# EAGLE design MICHAv41 (EAGLE 9.2.2)
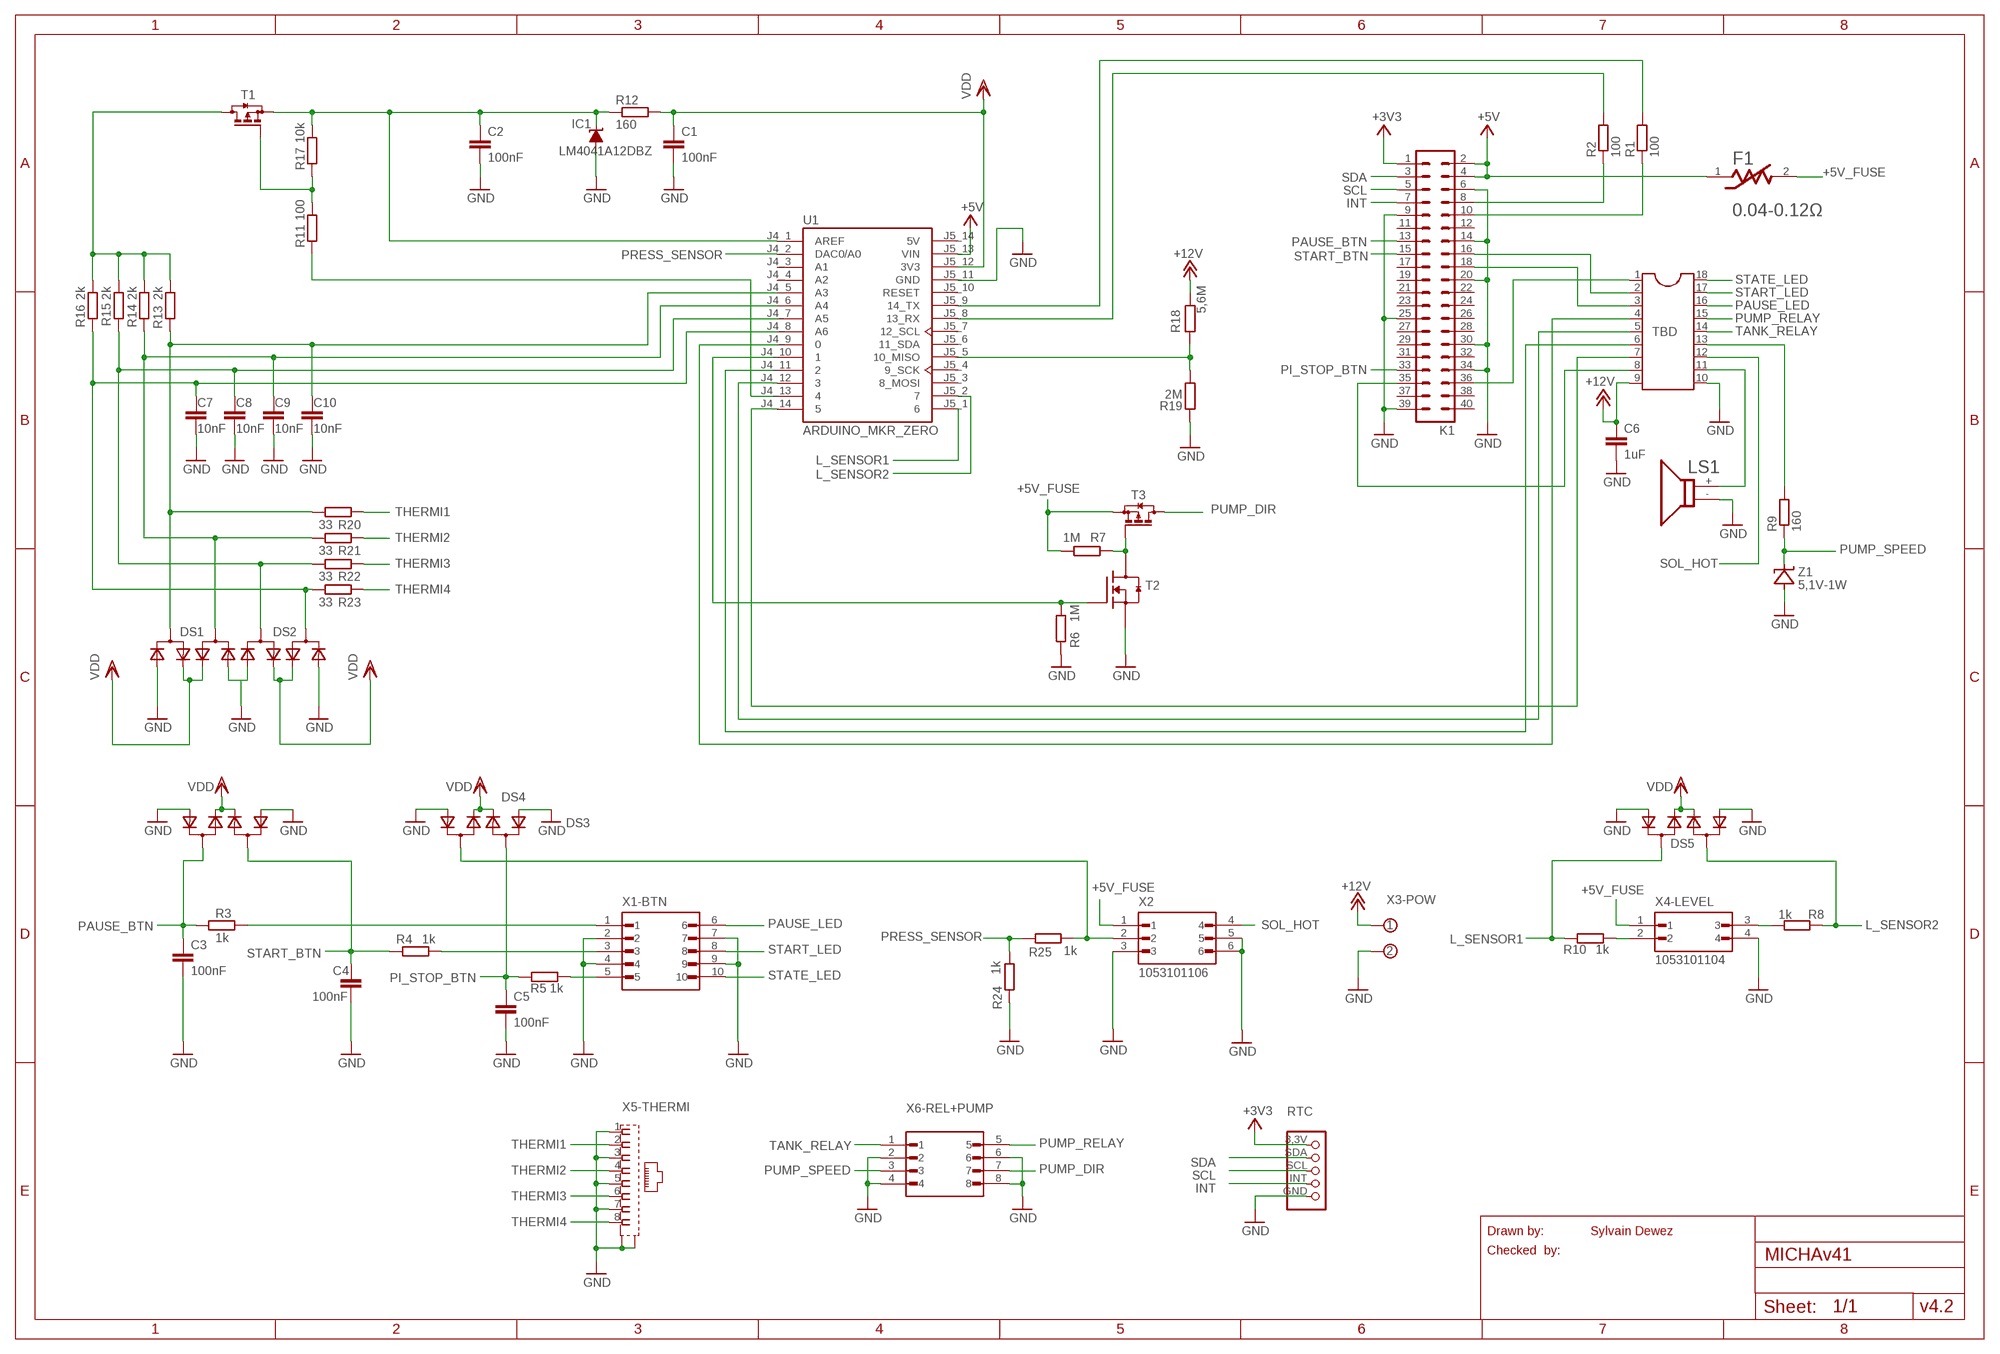
[diagram p0: schematic, sheet 1]

## Parts
C1  100nF  C-EUC1206  [C1206]
C2  100nF  C-EUC1206  [C1206]
C3  100nF  C-EUC1206  [C1206]
C4  100nF  C-EUC1206  [C1206]
C5  100nF  C-EUC1206  [C1206]
C6  1uF  C-EUC1206  [C1206]
C7  10nF  C-EUC1206  [C1206]
C8  10nF  C-EUC1206  [C1206]
C9  10nF  C-EUC1206  [C1206]
C10  10nF  C-EUC1206  [C1206]
DS1  CMXSH2-4LSTRPBFREE  [CMXSH2-4LSTRPBFREE]
DS2  CMXSH2-4LSTRPBFREE  [CMXSH2-4LSTRPBFREE]
DS3  CMXSH2-4LSTRPBFREE  [CMXSH2-4LSTRPBFREE]
DS4  CMXSH2-4LSTRPBFREE  [CMXSH2-4LSTRPBFREE]
DS5  CMXSH2-4LSTRPBFREE  [CMXSH2-4LSTRPBFREE]
F1  LITTELFUSE_INC_1206L150THWRLITTELFUSE_INC_1206L150THWR_0_0  [LITTELFUSE_INC_1206L150THWR_0]
IC1  LM4041A12DBZ  [DBZ_R-PDSO-G3]
K1  PIN20X2  [PIN_20X2]
LS1  RSPRO-BUZZER-7800743  [RSPRO-BUZZER-7800743]
R1  100  R-EU_R1206  [R1206]
R2  100  R-EU_R1206  [R1206]
R3  1k  R-EU_R1206  [R1206]
R4  1k  R-EU_R1206  [R1206]
R5  1k  R-EU_R1206  [R1206]
R6  1M  R-EU_R1206  [R1206]
R7  1M  R-EU_R1206  [R1206]
R8  1k  R-EU_R1206  [R1206]
R9  160  R-EU_R1206  [R1206]
R10  1k  R-EU_R1206  [R1206]
R11  100  R-EU_R1206  [R1206]
R12  160  R-EU_R1206  [R1206]
R13  2k  R-EU_R1206  [R1206]
R14  2k  R-EU_R1206  [R1206]
R15  2k  R-EU_R1206  [R1206]
R16  2k  R-EU_R1206  [R1206]
R17  10k  R-EU_R1206  [R1206]
R18  5,6M  R-EU_R1206  [R1206]
R19  2M  R-EU_R1206  [R1206]
R20  33  R-EU_R1206  [R1206]
R21  33  R-EU_R1206  [R1206]
R22  33  R-EU_R1206  [R1206]
R23  33  R-EU_R1206  [R1206]
R24  1k  R-EU_R1206  [R1206]
R25  1k  R-EU_R1206  [R1206]
RTC  ODROID_C4_RTC_SHIELD  [ODROID_C4_RTC_SHIELD]
T1  BSS84  [SOT23]
T2  MOSFET-NCH_SOT-23  [SOT95P280X135-3N]
T3  BSS84  [SOT23]
TBD  DIL18S  [SOCKET-18]
U1  ARDUINO_MKR_ZERO  [MODULE_ARDUINO_MKR_ZERO]
X1-BTN  1053101110  [MOLEX_1053101110]
X2  1053101106  [MOLEX_1053101106]
X3-POW  BUCHANAN_2_3.2MM  [BUCHANAN_2_3.5MM]
X4-LEVEL  1053101104  [MOLEX_1053101104]
X5-THERMI  SS-7188S-A-NF_V2  [BEL_SS-7188S-A-NF]
X6-REL+PUMP  1053101108  [MOLEX_1053101108]
Z1  5,1V-1W  ZENER_SMA  [ZENER_SMA]

## Nets
+3V3: K1.1 RTC.3,3V
+5V: F1.1 K1.2 K1.4 U1.J5_13(VIN)
+5V_FUSE: F1.2 R7.2 T3.2(S) X2.1 X4-LEVEL.1
+12V: C6.1 R18.2 TBD.9 X3-POW.1(KL)
BLACKOUT: R18.1 R19.2 U1.J5_5(10_MISO)
BTN_PAUSE: R3.2 X1-BTN.1
BTN_START: R4.2 X1-BTN.3
BTN_STOP: R5.2 X1-BTN.5
D0: TBD.4 U1.J4_9
D1: R6.2 T2.1(G) U1.J4_10
D2: TBD.6 U1.J4_11
D3: TBD.5 U1.J4_12
D5: TBD.7 U1.J4_14
D21: R11.1 U1.J4_13
GND: C1.2 C2.2 C3.2 C4.2 C5.2 C6.2 C7.2 C8.2 C9.2 C10.2 DS1.1(A3) DS1.6(A2) DS2.1(A3) DS2.6(A2) DS3.1(A3) DS3.6(A2) DS4.1(A3) DS4.6(A2) DS5.1(A3) DS5.6(A2) IC1.2(A) K1.6 K1.9 K1.14 K1.20 K1.25 K1.30 K1.34 K1.39 LS1.- R6.1 R19.1 R24.1 RTC.GND T2.2(S) TBD.10 U1.J5_11(GND) X1-BTN.2 X1-BTN.4 X1-BTN.7 X1-BTN.9 X2.3 X2.5 X2.6 X3-POW.2(KL1) X4-LEVEL.4 X5-THERMI.1 X5-THERMI.3 X5-THERMI.5 X5-THERMI.7 X5-THERMI.S1(GND1) X5-THERMI.S2(GND2) X6-REL+PUMP.2 X6-REL+PUMP.4 X6-REL+PUMP.6 X6-REL+PUMP.8 Z1.A
INT: K1.7 RTC.INT
L_SENSOR1: DS5.5(C) R10.1 U1.J5_1
L_SENSOR2: DS5.2(C1) R8.1 U1.J5_2
N$1: K1.36 TBD.1
N$2: R9.2 TBD.13
N$3: R11.2 R17.1 T1.1(G)
N$4: C2.1 IC1.1(C) R12.1 R17.2 T1.2(S) U1.J4_1(AREF)
N$6: R13.1 R14.1 R15.1 R16.1 T1.3(D)
N$11: C10.1 DS1.2(C1) R13.2 R20.1 U1.J4_5(A3)
N$12: C9.1 DS1.5(C) R14.2 R21.1 U1.J4_6(A4)
N$13: C8.1 DS2.2(C1) R15.2 R22.1 U1.J4_7(A5)
N$14: C7.1 DS2.5(C) R16.2 R23.1 U1.J4_8(A6)
N$26: LS1.+ TBD.11
N$27: R7.1 T2.3(D) T3.1(G)
PAUSE_BTN: C3.1 DS3.5(C) K1.13 R3.1
PAUSE_LED: TBD.16 X1-BTN.6
PI16: K1.16 TBD.2
PI18: K1.18 TBD.3
PI33: K1.35 TBD.8
PI_STOP_BTN: C5.1 DS4.2(C1) K1.33 R5.1
PRESS_SENSOR: R24.2 R25.1 U1.J4_2(DAC0/A0)
PUMP_DIR: T3.3(D) X6-REL+PUMP.7
PUMP_RELAY: TBD.15 X6-REL+PUMP.5
PUMP_SPEED: R9.1 X6-REL+PUMP.3 Z1.C
RX_A: R2.2 U1.J5_8(13_RX)
RX_PI: K1.10 R1.1
SCL: K1.5 RTC.SCL
SDA: K1.3 RTC.SDA
SENSOR: DS4.5(C) R25.2 X2.2
SENSOR1: R10.2 X4-LEVEL.2
SENSOR2: R8.2 X4-LEVEL.3
SOL_HOT: TBD.12 X2.4
START_BTN: C4.1 DS3.2(C1) K1.15 R4.1
START_LED: TBD.17 X1-BTN.8
STATE_LED: TBD.18 X1-BTN.10
TANK_RELAY: TBD.14 X6-REL+PUMP.1
THERMI1: R20.2 X5-THERMI.2
THERMI2: R21.2 X5-THERMI.4
THERMI3: R22.2 X5-THERMI.6
THERMI4: R23.2 X5-THERMI.8
TX_A: R1.2 U1.J5_9(14_TX)
TX_PI: K1.8 R2.1
VDD: C1.1 DS1.3(A4) DS1.4(A1) DS2.3(A4) DS2.4(A1) DS3.3(A4) DS3.4(A1) DS4.3(A4) DS4.4(A1) DS5.3(A4) DS5.4(A1) R12.2 U1.J5_12(3V3)
Unconnected: K1.11 K1.12 K1.17 K1.19 K1.21 K1.22 K1.23 K1.24 K1.26 K1.27 K1.28 K1.29 K1.31 K1.32 K1.37 K1.38 K1.40 U1.J4_3(A1) U1.J4_4(A2) U1.J5_3(8_MOSI) U1.J5_4(9_SCK) U1.J5_6(11_SDA) U1.J5_7(12_SCL) U1.J5_10(RESET)

## Notes on the sheet
- Drawn by: | Sylvain Dewez
- Checked  by:
- v4.2

## Power pins joined to a net without a drawn wire
5V: U1.J5_14(5V)

## Library data of the parts
C1-C10 = rcl:C-EU: CAPACITOR, European symbol; SPICEPREFIX: C
DS1-DS5 = SchottkyDiodes_SDM10M45SD:CMXSH2-4LSTRPBFREE
F1 = Littelfuse Inc - 1206L150THWR_1:LITTELFUSE_INC_1206L150THWR: Polymeric PTC Resettable Fuse 8V 1.5A Ih Surface Mount 1206 (3216 Metric), Concave; AMBIENT_TEMPERATURE_RANGE_HIGH: +85°C; AMBIENT_TEMPERATURE_RANGE_LOW: -40°C; AUTOMOTIVE: No; CENTROID_NOT_SPECIFIED: No; CURRENT_RATING: 100A; DATASHEET: https://www.littelfuse.com/~/media/electronics/datasheets/resettable_ptcs/littelfuse_ptc_1206l_datasheet.pdf.pdf; DEVICE_CLASS_L1: Circuit Protection; DEVICE_CLASS_L2: PTC Resettable Fuses; DEVICE_CLASS_L3: unset; DIGIKEY_DESCRIPTION: PTC RESET FUSE 8V 1.5A 1206; DIGIKEY_PART_NUMBER: F3372CT-ND; FOOTPRINT_VARIANT_NAME_0: Recommended_Land_Pattern; HEIGHT: 1mm; HOLD_CURRENT: 1.5A; LEAD_FREE: Yes; MF: Littelfuse Inc; MFG_PACKAGE_IDENT: 0; MFG_PACKAGE_IDENT_DATE: 0; MFG_PACKAGE_IDENT_REV: 0; MOUSER_DESCRIPTION: Resettable Fuses - PPTC PTC 6V 1206 1.5A POLYFUSE SMD THIN; MOUSER_PART_NUMBER: 576-1206L150THWR; MPN: 1206L150THWR; PACKAGE: 1206; PREFIX: F; RESISTANCE: 0.04-0.12Ω; ROHS: Yes; TEMPERATURE_RANGE_HIGH: +85°C; TEMPERATURE_RANGE_LOW: -40°C; TRIP_CURRENT: 3A; TRIP_TIME: 0.3s; VERIFICATION_VERSION: 0.0.0.3; VOLTAGE_RATING: 8V
IC1 = texas:LM4041: PRECISION MICROPOWER SHUNT VOLTAGE REFERENCE Source: http://focus.ti.com/lit/ds/slcs146e/slcs146e.pdf; MPN: LM4041A12IDBZR; OC_FARNELL: 1407949; OC_NEWARK: 58K5875
K1 = FLYFISH:PIN20X2
LS1 = RSpro-buzzer-7800743:RSPRO-BUZZER-7800743: Rs pro piezo buzzer 780-0743 Diamètre: 16 mm Hauteur: 14,5 mm Empattement: 7,6 mm Diamètre trou: 0,7 mm Tension de fonctionnement: 9-15 V Courant de fonctionnement: 40 mA Résistance: 115 ohms Référence: 780-0743 Datasheet: https://docs.rs-online.com/ff3f/0900766b81582bd9.pdf
R1-R8 R10 R11 R13-R25 = resistor:R-EU_: RESISTOR, European symbol
R9 R12 = rcl:R-EU_: RESISTOR, European symbol; SPICEPREFIX: R
RTC = Odroid_C4_RTC_SHIELD:ODROID_C4_RTC_SHIELD
T1 T3 = transistor-small-signal:BSS84: P-CHANNEL MOS FET
T2 = ipc-7351-transistor:MOSFET-NCH_
TBD = ic-package:DIL18: Dual In Line / Socket
U1 = ARDUINO_MKR_ZERO:ARDUINO_MKR_ZERO: ATSAMD21 Arduino MKR Zero with Headers SAM D ARM® Cortex®-M0+ MCU 32-Bit Embedded Evaluation Board; AVAILABILITY: Unavailable; DESCRIPTION: ATSAMD21 Arduino MKR Zero with Headers SAM D ARM® Cortex®-M0+ MCU 32-Bit Embedded Evaluation Board; MF: Arduino; MP: ARDUINO MKR ZERO; PACKAGE: None; PRICE: None
X1-BTN = con-molex-nanoFit-105310-1110:1053101110: Nano-Fit Vertical Header, Through Hole, 2.50mm Pitch, Dual Row, 8 Circuits, with Kinked Pins, Tin (Sn) Plating, Black, Glow-Wire Capable, Tray; MANUFACTURER: Molex; MAXIMUM_PACKAGE_HEIGHT: 10.51 mm; PARTREV: H; STANDARD: Manufacturer Recommendations
X2 = con-molex-nanoFit-105310-1106:1053101106: Nano-Fit Vertical Header, Through Hole, 2.50mm Pitch, Dual Row, 6 Circuits, with Kinked Pins, Tin (Sn) Plating, Black, Glow-Wire Capable, Tray; MANUFACTURER: Molex; MAXIMUM_PACKAGE_HEIGHT: 10.51 mm; PARTREV: H; STANDARD: Manufacturer Recommendations
X3-POW = con-TEconnectivity:BUCHANAN_2_3.2MM
X4-LEVEL = con-molex-nanoFit-105310-1104:1053101104: Nano-Fit Vertical Header, Through Hole, 2.50mm Pitch, Dual Row, 4 Circuits, with Kinked Pins, Tin (Sn) Plating, Black, Glow-Wire Capable, Tray; MANUFACTURER: Molex; MAXIMUM_PACKAGE_HEIGHT: 10.51 mm; PARTREV: H; STANDARD: Manufacturer Recommendations
X5-THERMI = SS-7188S-A-NF:SS-7188S-A-NF_V2: Modular Jack | CAT5E | Horizontal (90) | 8P 8C | NF Shielded Check prices <https://pricing.snapeda.com/parts/SS-7188S-A-NF/Stewart%20Connector/view-part?ref=eda>; AVAILABILITY: Warning; DESCRIPTION: Jack Modular Connector 8p8c (RJ45, Ethernet) 90° Angle (Right) Shielded Cat5e; MF: Stewart Connector; MP: SS-7188S-A-NF; PACKAGE: None; PRICE: None; PURCHASE-URL: https://pricing.snapeda.com/search/part/SS-7188S-A-NF/?ref=eda
X6-REL+PUMP = con-molex-nanoFit-105310-1108:1053101108: Nano-Fit Vertical Header, Through Hole, 2.50mm Pitch, Dual Row, 8 Circuits, with Kinked Pins, Tin (Sn) Plating, Black, Glow-Wire Capable, Tray; MANUFACTURER: Molex; MAXIMUM_PACKAGE_HEIGHT: 10.51 mm; PARTREV: H; STANDARD: Manufacturer Recommendations
Z1 = Zener_SMA:ZENER_SMA

## Board
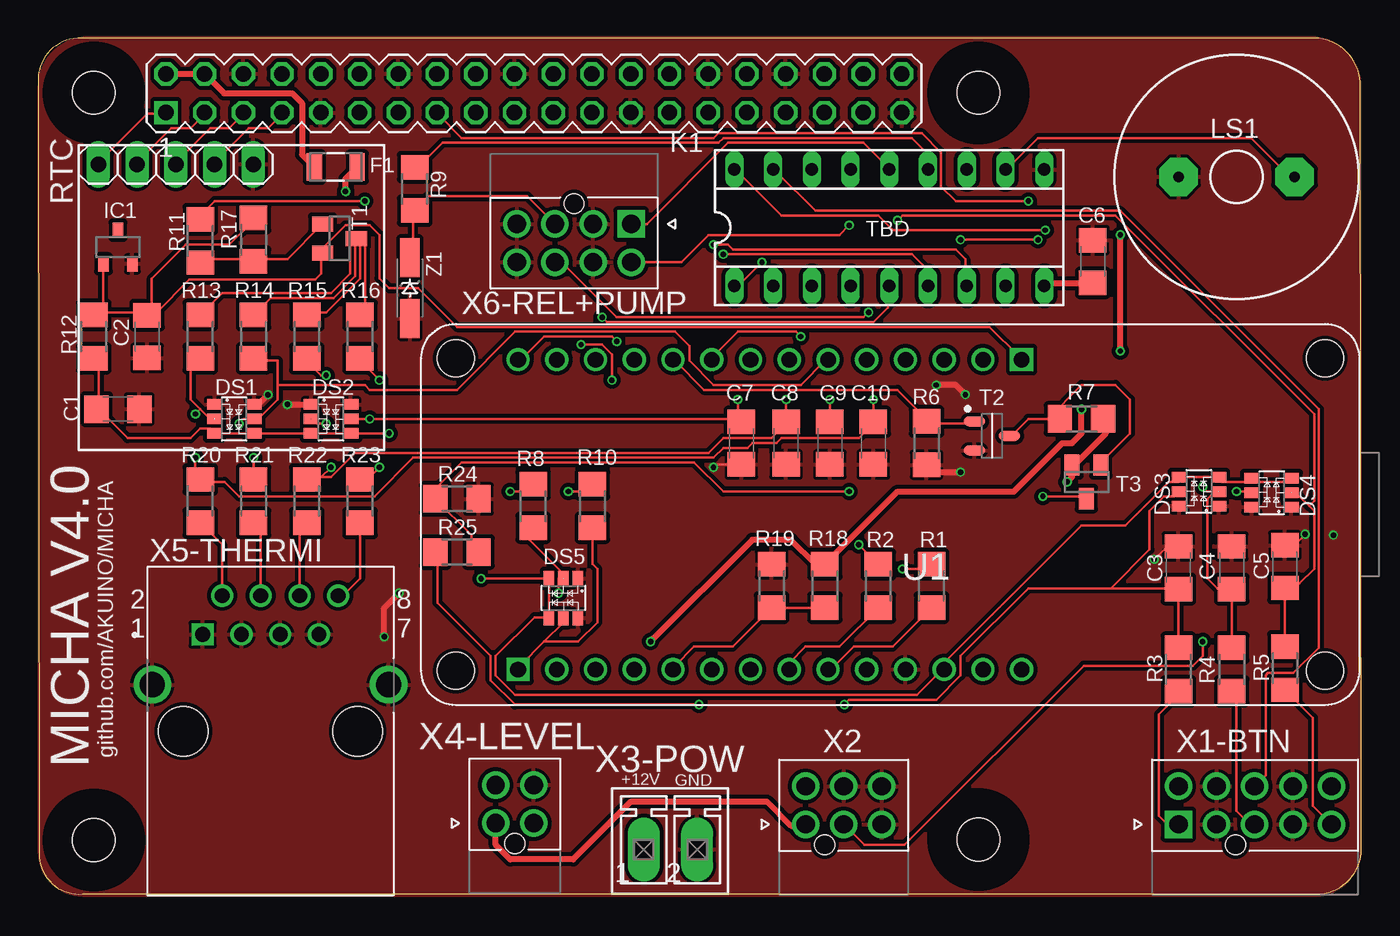
[diagram p1: board, top side]
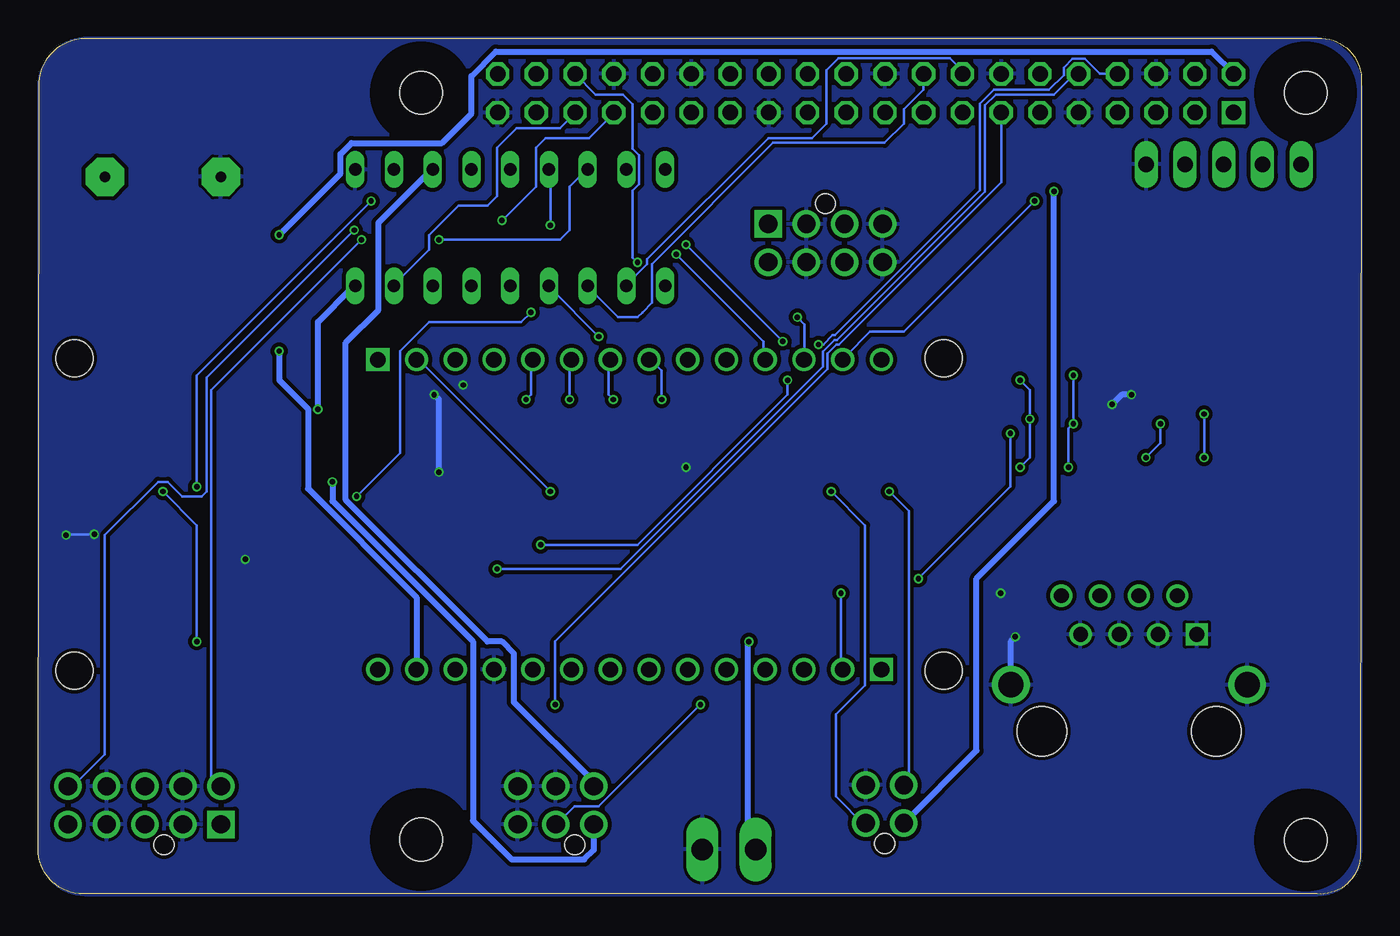
[diagram p2: board, bottom side, seen from below]

Size 86.76 x 56.13 mm. Coordinates in mm from the lower left corner, seen from the top.
Outline: 0.08,2.38 arc90 2.91,0.01 83.81,0.01 arc90 86.76,2.96 86.68,53.25 arc90 83.41,56.12 2.84,56.12 arc90 0,53.52 0.08,2.38
Copper layers (1*16): Top 0.018mm / dielectric 1.55mm / Bottom 0.018mm
Design rules "eC_2Layer_PClass6_BaseCopperO18_eCDefault *": minimum track width 6mil, minimum drill 0.35mm, track to track 0.15mm, track to pad 0.15mm, pad to pad 0.15mm, via to via 0.15mm, smd to smd 0mil, copper to edge 0mil, drill to drill 0.35mm, minimum pad ring 0.175mm, minimum via ring 0.125mm, stop-mask expansion 0mil, vias tented up to drill 0.45mm, thermal gap 0.2mm
Holes 2.8 mm at 3.65,3.54 3.65,52.54 61.65,52.54 61.65,3.57
tRestrict: area 2.1,51 to 5.2,54.1; area 60.1,51 to 63.2,54.1; area 2.1,2 to 5.2,5.1; area 60.1,2 to 63.2,5.1
bRestrict: area 2.1,2 to 5.2,5.1; area 2.1,51 to 5.2,54.1; area 60.1,51 to 63.2,54.1; area 60.1,2 to 63.2,5.1

### Footprints (pad centres in the part's own frame; a part is rotated, then mirrored left to right if it is on the bottom)
C1206 = smd 1.6 x 1.8: 1 -1.4,0; 2 1.4,0
CMXSH2-4LSTRPBFREE = smd 0.69 x 0.99: 1 -0.95,-1.29; 2 0,-1.29; 3 0.95,-1.29; 4 0.95,1.3; 5 0,1.3; 6 -0.95,1.3
LITTELFUSE_INC_1206L150THWR_0 = smd 1 x 1.8: 1 -1.4,0; 2 1.4,0
DBZ_R-PDSO-G3 = smd 0.7 x 1: 1 -0.95,-1.1; 2 0.95,-1.1; 3 0,1.1
PIN_20X2 = drill 1.016 square: 1 -24.13,-1.27 | drill 1.016 octagon: 2 -24.13,1.27; 3 -21.59,-1.27; 4 -21.59,1.27; 5 -19.05,-1.27; 6 -19.05,1.27; 7 -16.51,-1.27; 8 -16.51,1.27; 9 -13.97,-1.27; 10 -13.97,1.27; 11 -11.43,-1.27; 12 -11.43,1.27; 13 -8.89,-1.27; 14 -8.89,1.27; 15 -6.35,-1.27; 16 -6.35,1.27; 17 -3.81,-1.27; 18 -3.81,1.27; 19 -1.27,-1.27; 20 -1.27,1.27; 21 1.27,-1.27; 22 1.27,1.27; 23 3.81,-1.27; 24 3.81,1.27; 25 6.35,-1.27; 26 6.35,1.27; 27 8.89,-1.27; 28 8.89,1.27; 29 11.43,-1.27; 30 11.43,1.27; 31 13.97,-1.27; 32 13.97,1.27; 33 16.51,-1.27; 34 16.51,1.27; 35 19.05,-1.27; 36 19.05,1.27; 37 21.59,-1.27; 38 21.59,1.27; 39 24.13,-1.27; 40 24.13,1.27
RSPRO-BUZZER-7800743 = drill 0.7 pad 2.54 octagon: + 3.8,0; - -3.8,0
R1206 = smd 1.6 x 1.803: 1 -1.422,0; 2 1.422,0
ODROID_C4_RTC_SHIELD = drill 1.016 long: 3,3V -5.08,0; GND 5.08,0; INT 2.54,0; SCL 0,0; SDA -2.54,0
SOT23 = smd 1 x 1.4: 1 -0.95,-1.1; 2 0.95,-1.1; 3 0,1.1
SOT95P280X135-3N = smd 1.4 x 0.65: 1 -1.15,0.95; 2 -1.15,-0.95; 3 1.15,0
SOCKET-18 = drill 0.813 long: 1 -10.16,-3.81; 2 -7.62,-3.81; 3 -5.08,-3.81; 4 -2.54,-3.81; 5 0,-3.81; 6 2.54,-3.81; 7 5.08,-3.81; 8 7.62,-3.81; 9 10.16,-3.81; 10 10.16,3.81; 11 7.62,3.81; 12 5.08,3.81; 13 2.54,3.81; 14 0,3.81; 15 -2.54,3.81; 16 -5.08,3.81; 17 -7.62,3.81; 18 -10.16,3.81
MODULE_ARDUINO_MKR_ZERO = drill 1.02 square: J4_1 -8.615,-10.16; J5_1 24.405,10.16 | drill 1.02: J4_2 -6.075,-10.16; J4_3 -3.535,-10.16; J4_4 -0.995,-10.16; J4_5 1.545,-10.16; J4_6 4.085,-10.16; J4_7 6.625,-10.16; J4_8 9.165,-10.16; J4_9 11.705,-10.16; J4_10 14.245,-10.16; J4_11 16.785,-10.16; J4_12 19.325,-10.16; J4_13 21.865,-10.16; J4_14 24.405,-10.16; J5_2 21.865,10.16; J5_3 19.325,10.16; J5_4 16.785,10.16; J5_5 14.245,10.16; J5_6 11.705,10.16; J5_7 9.165,10.16; J5_8 6.625,10.16; J5_9 4.085,10.16; J5_10 1.545,10.16; J5_11 -0.995,10.16; J5_12 -3.535,10.16; J5_13 -6.075,10.16; J5_14 -8.615,10.16 | hole 2.42: -28.5,-10.25; -28.5,10.25; 28.5,10.25; 28.5,-10.25
MOLEX_1053101110 = drill 1.2 pad 1.7 square: 1 0,0 | drill 1.2 pad 1.7: 2 2.5,0; 3 5,0; 4 7.5,0; 5 10.04,0; 6 0,2.5; 7 2.5,2.5; 8 5,2.5; 9 7.5,2.5; 10 10.04,2.5 | hole 1.3: 3.75,-1.34
MOLEX_1053101106 = drill 1.2 pad 1.7: 1 0,0; 2 2.5,0; 3 5,0; 4 0,2.5; 5 2.5,2.5; 6 5,2.5 | hole 1.3: 1.25,-1.34
BUCHANAN_2_3.5MM = drill 1.397 long: 1 -1.722,0; 2 1.778,0
MOLEX_1053101104 = drill 1.2 pad 1.7: 1 0,0; 2 2.5,0; 3 0,2.5; 4 2.5,2.5 | hole 1.3: 1.25,-1.34
BEL_SS-7188S-A-NF = drill 0.97 square: 1 -4.445,6.35 | drill 0.97: 2 -3.175,8.89; 3 -1.905,6.35; 4 -0.635,8.89; 5 0.635,6.35; 6 1.905,8.89; 7 3.175,6.35; 8 4.445,8.89 | drill 1.65: S1 -7.745,3.05; S2 7.745,3.05 | hole 3.25: 5.715,0; -5.715,0
MOLEX_1053101108 = drill 1.2 pad 1.7 square: 1 0,0 | drill 1.2 pad 1.7: 2 2.5,0; 3 5,0; 4 7.5,0; 5 0,2.5; 6 2.5,2.5; 7 5,2.5; 8 7.5,2.5 | hole 1.3: 3.75,-1.34
ZENER_SMA = smd 2.54 x 1.27: A 2,0; C -2,0

### Placement (x,y rotation side)
C1  5.23,31.79 0 top
C2  7.14,36.56 270 top
C3  74.76,21.4 90 top
C4  78.26,21.4 90 top
C5  81.75,21.48 90 top
C6  69.14,41.48 90 top
C7  46.11,29.57 270 top
C8  49.05,29.57 270 top
C9  51.9,29.57 270 top
C10  54.76,29.57 270 top
DS1  12.85,31.16 270 top
DS2  19.2,31.16 270 top
DS3  76.11,26.4 90 top
DS4  80.88,26.32 90 top
DS5  34.44,19.41 180 top
F1  19.52,47.67 0 top
IC1  5.23,42.43 0 top
K1  32.5,52.51 0 top
LS1  78.57,47.03 0 top
R1  58.57,20.21 270 top
R2  55.08,20.21 270 top
R3  74.76,14.73 270 top
R4  78.26,14.73 270 top
R5  81.75,14.81 270 top
R6  58.25,29.57 90 top
R7  68.41,31.16 0 top
R8  32.46,25.44 90 top
R9  24.69,46.24 90 top
R10  36.35,25.44 90 top
R11  10.63,42.83 270 top
R12  3.64,36.56 270 top
R13  10.63,36.56 270 top
R14  14.12,36.56 270 top
R15  17.61,36.56 270 top
R16  21.11,36.56 270 top
R17  14.12,42.91 90 top
R18  51.59,20.21 90 top
R19  48.09,20.21 270 top
R20  10.63,25.76 270 top
R21  14.12,25.76 270 top
R22  17.61,25.76 270 top
R23  21.11,25.76 270 top
R24  27.46,25.92 180 top
R25  27.46,22.43 180 top
RTC  9.02,47.85 0 top
T1  19.76,42.99 270 top
T2  62.54,30.05 0 top
T3  68.73,27.03 180 top
TBD  55.8,43.7 0 top
U1  55.87,24.89 180 top
X1-BTN  74.76,4.57 0 top
X2  50.32,4.57 0 top
X3-POW  41.43,2.92 0 top
X4-LEVEL  30,4.65 0 top
X5-THERMI  15.23,10.68 0 top
X6-REL+PUMP  38.89,43.94 180 top
Z1  24.37,39.73 270 top

### Tracks (layer width: path | path; a pad name or v marks a point on that pad's centre or on a via)
+3V3
  Top 0.152: RTC.3,3V 3.96,47.99 7.14,51.16 8.09,51.16 K1.1
+5V  (via drill 0.35)
  Top 0.406: K1.2 K1.4 12.19,52.51 16.66,52.51 17.3,51.88 17.3,48.49 F1.1 | v70.95,35.6 v70.95,43.22
  Bottom 0.406: v70.95,35.6 70.95,33.7 69.07,31.81 69.07,26.58 61.95,19.46 U1.J5_13 | v70.95,43.22 66.93,47.25 66.93,48.52 66.21,49.24 60.28,49.24 58.35,51.18 58.35,53.64 56.75,55.24 9.83,55.24 K1.2
+5V_FUSE  (via drill 0.35)
  Top 0.152: 68.1,28.3 T3.2 | 70,31.16 R7.2
  Top 0.406: v20.16,46.08 20.16,46.9 F1.2 | X2.1 50.24,4.49 49.36,4.49 47.78,6.08 38.89,6.08 35.08,2.27 30.95,2.27 30,3.22 X4-LEVEL.1 | 68.1,28.3 70,30.21 70,31.16 | T3.2 67.78,27.35 v67.46,27.03
  Bottom 0.406: X4-LEVEL.1 25.23,9.41 25.23,20.68 20.16,25.76 v20.16,46.08 | v67.46,27.03 67.46,25.76 58.25,16.55 58.25,4.81 55.71,2.27 50.95,2.27 50.32,2.9 X2.1
+12V  (via drill 0.35)
  Top 0.152: 69.05,40.05 C6.1 | 50.95,21.63 R18.2
  Top 0.406: 69.05,40.05 66.19,40.05 TBD.9 | R18.2 56.35,26.4 63.97,26.4 67.15,29.57 67.78,29.57 68.42,30.21 v68.42,31.79 | v40.16,16.55 46.82,23.22 49.36,23.22 50.95,21.63
  Bottom 0.152: 39.84,3.22 X3-POW.1
  Bottom 0.406: v68.42,31.79 68.42,37.51 66.19,39.73 TBD.9 | 39.84,3.22 40.24,3.62 40.24,16.48 v40.16,16.55
BLACKOUT
  Top 0.152: R19.2 R18.1 | R19.2 45.56,16.24 43.01,16.24 41.75,14.97 U1.J5_5 | R19.2
BTN_PAUSE
  Top 0.152: R3.2 74.76,13.06 73.5,11.79 73.5,5.12 74.05,4.57 X1-BTN.1
BTN_START
  Top 0.152: R4.2 78.57,12.99 78.57,5.44 79.45,4.57 X1-BTN.3
BTN_STOP
  Top 0.152: R5.2 83.58,11.56 83.58,5.8 X1-BTN.5
D0  (via drill 0.35)
  Top 0.152: v50,36.56 49.68,36.87 45.87,36.87 44.29,35.29 U1.J4_9
  Bottom 0.152: v50,36.56 53.18,39.73 TBD.4
D1
  Top 0.152: T2.1 61.11,30.84 58.25,30.84 R6.2 58.25,31.16 56.35,33.06 43.65,33.06 41.75,34.97 U1.J4_10
D2  (via drill 0.35)
  Top 0.152: v44.92,41.95 57.3,41.95 58.25,41 58.25,40.05 TBD.6
  Bottom 0.152: v44.92,41.95 39.21,36.24 39.21,35.29 U1.J4_11
D3  (via drill 0.35)
  Top 0.152: v36.98,37.83 37.3,37.51 54.76,37.51 55.71,38.46 55.71,39.73 TBD.5
  Bottom 0.152: v36.98,37.83 36.51,37.35 36.51,35.09 U1.J4_12
D5  (via drill 0.35)
  Top 0.152: v44.29,42.59 45.24,42.59 45.56,42.27 60.16,42.27 60.79,41.64 60.79,40.05 TBD.7 | v37.93,36.24 37.62,36.56 33.17,36.56 31.9,35.29 31.59,35.29 U1.J4_14
  Bottom 0.152: v37.93,36.24 v44.29,42.59
D21  (via drill 0.35)
  Top 0.152: v21.43,45.45 11.58,45.45 10.63,44.49 R11.1
  Bottom 0.152: v21.43,45.45 30,36.87 32.22,36.87 33.81,35.29 U1.J4_13
GND  (via drill 0.35)
  Top 0.152: C5.2 82.36,22.88 v83.07,23.59 | C7.2 44.47,28.17 v44.29,27.98 | C3.2 74.02,22.8 v73.18,21.95
  Top 0.406: R6.1 58.74,27.67 v60.48,27.67 | v60.79,32.75 60.16,33.38 v58.89,33.38 | v22.7,16.87 22.7,18.78 v23.65,19.73 | DS1.6 14.44,32.11 v15.07,32.75 | v16.34,32.11 v16.35,32.11 DS2.1
  Bottom 0.152: v83.07,23.59 84.87,23.59 v84.92,23.54
  Bottom 0.406: v60.48,27.67 60.48,32.43 v60.79,32.75 | X5-THERMI.S2 22.98,16.59 v22.7,16.87 | v15.07,32.75 15.71,32.75 v16.34,32.11
  pour Bottom (isolate 0.254): 0.08,2.81 arc90 2.92,-0.04 83.65,-0.04 arc90 86.66,2.98 86.66,52.89 arc90 83.42,56.12 3.32,56.12 arc90 0.08,52.89
  pour Top (isolate 0.254): 0.08,2.81 arc90 2.92,-0.04 83.84,-0.04 arc90 86.66,3.12 86.66,52.89 arc90 83.42,56.12 3.32,56.12 arc90 0.08,52.89
INT
  Top 0.152: RTC.INT 11.58,47.99 13.8,50.21 15.07,50.21 16.03,51.16 K1.7
L_SENSOR1
  Top 0.152: 33.17,16.55 31.59,14.97 U1.J5_1 | 33.17,16.55 34.44,17.82 DS5.5 | R10.1 36.35,21.63 36.67,21.32 36.67,17.82 35.39,16.55 33.17,16.55
L_SENSOR2  (via drill 0.35)
  Top 0.152: R8.1 32.22,23.86 32.22,23.22 34.44,21 DS5.2 34.44,20.68 34.12,20.68 v34.12,19.73
  Bottom 0.152: v34.12,19.73 34.12,14.97 U1.J5_2
N$1  (via drill 0.35)
  Top 0.152: v47.46,41.43 45.92,39.89 TBD.1
  Bottom 0.152: K1.36 50.2,52.43 48.41,52.43 47.78,51.8 47.78,48.9 47.35,48.47 47.35,46.56 47.78,46.13 47.78,41.75 v47.46,41.43
N$2
  Top 0.152: R9.2 24.92,47.67 26.5,49.26 44.6,49.26 44.92,49.57 57.3,49.57 58.25,48.62 58.25,47.67 TBD.13
N$3
  Top 0.152: 14.12,41.64 16.34,41.64 18.57,43.86 T1.1 | 14.12,41.64 10.63,41.64 R11.2 | 14.12,41.64 R17.1
N$4
  Top 0.152: 4.28,38.14 4.28,41.32 IC1.1 | 4.28,38.14 3.65,38.14 R12.1 4.28,38.14 | 7.14,38.14 7.46,38.14 | 7.46,38.14 7.77,38.14 9.92,40.29 18.17,40.29 18.57,40.68 18.57,41.95 T1.2 18.57,42.27 20.16,43.86 21.74,43.86 22.38,43.22 22.38,40.37 23.01,39.73 24.92,39.73 27.46,37.19 62.38,37.19 64.29,35.29 U1.J4_1 | 7.46,38.14 7.46,40.37 9.68,42.59 12.54,42.59 14.12,44.18 R17.2 | 7.46,38.14 C2.1 7.14,38.14 | 7.14,38.14 4.28,38.14
N$6
  Top 0.152: R16.1 21.43,38.3 21.43,42.99 21.11,42.99 | 21.11,42.99 T1.3 | R15.1 17.78,38.14 18.89,38.14 21.11,40.37 21.11,42.99 | R14.1 15.24,39.1 19.36,39.1 20.79,40.53 20.79,42.92 T1.3 | R13.1 12.07,39.41 19.2,39.41 20.46,40.67 20.46,42.59 T1.3
N$11  (via drill 0.35)
  Top 0.152: v54.76,32.43 C10.1 54.76,30.84 53.81,29.89 48.73,29.89 48.41,29.57 46.82,29.57 46.51,29.25 44.92,29.25 44.29,28.62 24.6,28.62 22.06,26.08 13.17,26.08 12.22,27.03 10.63,27.03 R20.1 10.31,27.5 v10.31,28.62 | 10.63,31.79 9.99,32.43 9.99,34.97 10.63,34.97 R13.2 | 10.63,31.79 11.27,31.16 DS1.2 | 10.63,31.79 v10.31,31.48
  Bottom 0.152: v54.76,32.43 54.44,32.75 54.44,34.97 U1.J4_5 | v10.31,31.48 v10.31,28.62
N$12  (via drill 0.35)
  Top 0.152: v51.9,32.43 C9.1 | 15.71,33.38 15.71,34.97 14.12,34.97 R14.2 | 15.71,33.38 15.71,32.43 14.44,31.16 DS1.5 13.49,31.16 v13.17,30.84 | v14.12,28.62 R21.1 | 15.71,33.38 21.43,33.38 21.74,33.06 27.46,33.06 31.27,36.87 41.75,36.87 42.7,35.92 42.7,34.97 44.29,33.38 50,33.38 51.59,34.97 U1.J4_6
  Bottom 0.152: v51.9,32.43 51.9,34.97 U1.J4_6 | v14.12,28.62 13.17,29.57 v13.17,30.84
N$13  (via drill 0.35)
  Top 0.152: v49.05,32.43 C8.1 49.05,30.84 48.1,29.89 44.92,29.89 43.97,28.94 20.79,28.94 19.2,27.35 18.57,27.35 | v18.89,30.84 18.25,30.84 17.93,31.16 DS2.2 | 18.57,27.35 v19.2,27.98 | 18.57,27.35 17.61,27.35 R22.1 | v18.89,34.02 18.57,34.02 17.61,34.97 R15.2
  Bottom 0.152: v49.05,32.43 49.36,32.75 49.36,34.97 U1.J4_7 | v19.2,27.98 19.2,30.52 v18.89,30.84 v18.89,34.02
N$14  (via drill 0.35)
  Top 0.152: 45.87,31.16 45.56,31.16 | 45.56,31.16 v21.74,31.16 DS2.5 | 45.87,31.16 C7.1 45.56,31.16 | v22.38,27.98 21.58,27.18 R23.1 | v22.38,33.7 21.11,34.97 R16.2 | 45.87,31.16 v45.87,32.43
  Bottom 0.152: v22.38,27.98 21.74,28.62 v21.74,31.16 21.74,33.06 v22.38,33.7 | v45.87,32.43 45.87,34.33 46.51,34.97 U1.J4_8
N$26
  Top 0.152: TBD.11 63.65,47.67 65.56,49.57 79.53,49.57 82.07,47.03 LS1.+
N$27
  Top 0.152: 66.19,31.16 64.92,31.16 63.97,30.21 T2.3 | R7.1 66.19,31.16 | 66.19,31.16 68.42,33.38 70.64,33.38 71.59,32.43 71.59,30.21 69.68,28.3 T3.1
PAUSE_BTN  (via drill 0.35)
  Top 0.152: DS3.5 74.76,26.4 74.45,26.08 73.81,26.08 72.86,25.13 72.86,22.59 70.32,20.05 | R3.1 C3.1 74.76,20.05 70.32,20.05 | v52.86,12.43 53.18,12.74 58.89,12.74 60.48,14.33 60.48,15.6 64.92,20.05 70.32,20.05
  Bottom 0.152: v52.86,12.43 52.86,16.55 35,34.41 35,35.46 34.42,36.04 34.25,36.04 23.61,46.67 K1.13
PAUSE_LED  (via drill 0.35)
  Top 0.152: v65.56,42.91 v60.48,42.91
  Bottom 0.152: v60.48,42.91 52.54,42.91 51.9,43.54 51.9,46.4 50.95,47.35 TBD.16 | v65.56,42.91 75.4,33.06 75.4,7.7 X1-BTN.6
PI16
  Bottom 0.152: TBD.2 48.1,40.05 46.82,41.32 46.82,41.64 38.89,49.57 36.03,49.57 35.08,50.53 35.08,54.02 34.28,54.81 26.98,54.81 26.19,54.02 K1.16
PI18
  Bottom 0.152: TBD.3 50.64,39.73 48.73,37.83 47.46,37.83 47.14,38.14 46.51,38.78 46.51,41.32 38.57,49.26 31.27,49.26 30,50.53 30,51.48 28.73,52.75 28.73,53.7 K1.18
PI33
  Bottom 0.152: TBD.8 63.33,40.05 61.11,42.27 61.11,43.22 59.21,45.13 57.3,45.13 56.67,45.76 56.67,48.94 55.4,50.21 52.54,50.21 51.55,51.2 K1.35
PI_STOP_BTN  (via drill 0.35)
  Top 0.152: 83.34,25.44 83.65,25.13 83.65,21.32 82.7,20.36 81.75,20.36 C5.1 R5.1 | 83.34,25.44 82.7,26.08 82.39,26.08 DS4.2 | v56.35,44.18 56.67,44.49 70.64,44.49 83.65,31.48 83.65,25.76 83.34,25.44
  Bottom 0.152: v56.35,44.18 54.13,46.4 54.13,48.94 53.49,49.57 50.64,49.57 49.05,51.16 K1.33
PRESS_SENSOR  (via drill 0.35)
  Top 0.152: v53.18,26.4 44.92,26.4 43.01,28.3 27.77,28.3 26.04,26.56 R24.2 28.41,23.54 28.41,22.9 R25.1
  Bottom 0.152: v53.18,26.4 61.75,34.97 U1.J4_2
PUMP_DIR  (via drill 0.35)
  Top 0.152: v65.87,26.08 68.73,26.08 T3.3 | v54.44,38.14 54.13,37.83 37.93,37.83 34.32,41.44 X6-REL+PUMP.7
  Bottom 0.152: v65.87,26.08 63.02,28.94 63.02,35.6 61.11,37.51 55.08,37.51 v54.44,38.14
PUMP_RELAY  (via drill 0.35)
  Top 0.152: v53.18,43.86 52.54,43.22 43.97,43.22 42.18,41.44 X6-REL+PUMP.5
  Bottom 0.152: v53.18,43.86 53.18,47.35 TBD.15
PUMP_SPEED
  Top 0.152: Z1.C 24.6,41.95 24.6,44.81 R9.1 24.92,45.13 25.55,45.76 32.06,45.76 X6-REL+PUMP.3
RX_A
  Top 0.152: U1.J5_8 49.25,15.17 50.32,16.24 52.54,16.24 R2.2
RX_PI  (via drill 0.35)
  Top 0.152: v56.67,21.32 58.57,21.32 R1.1
  Bottom 0.152: v56.67,21.32 48.57,21.32 35.3,34.59 35.3,35.58 34.54,36.34 34.38,36.34 24.68,46.05 24.68,51.72 23.96,52.43 20.16,52.43 18.57,54.02 K1.10
SCL
  Top 0.152: RTC.SCL 9.04,47.99 11.27,50.21 12.54,50.21 13.49,51.16 K1.5
SDA
  Top 0.152: RTC.SDA 6.5,47.99 8.72,50.21 9.99,50.21 10.95,51.16 K1.3
SENSOR  (via drill 0.35)
  Top 0.152: v78.57,26.4 79.53,26.4 DS4.5 | v76.35,16.55 76.35,15.6 75.72,14.97 68.56,14.97 56.81,3.22 54.17,3.22 X2.2 | R25.2 26.19,22.27 26.19,19.09 29.68,15.6 29.68,14.01 31.27,12.43 v43.33,12.43
  Bottom 0.152: v78.57,26.4 76.35,24.17 v76.35,16.55 | v43.33,12.43 50,5.76 51.59,5.76 52.54,4.81 X2.2
SENSOR1  (via drill 0.35)
  Top 0.152: v34.76,26.4 36.03,26.4 36.35,26.71 R10.2
  Bottom 0.152: v34.76,26.4 32.54,24.17 32.54,13.7 34.44,11.79 34.44,6.39 32.54,4.49 X4-LEVEL.2
SENSOR2  (via drill 0.35)
  Top 0.152: v30.95,26.4 31.9,26.4 32.22,26.71 R8.2
  Bottom 0.152: v30.95,26.4 29.68,25.13 29.68,7.66 30,7.35 X4-LEVEL.3
SOL_HOT
  Bottom 0.406: TBD.12 61.11,47.35 64.45,44.02 64.45,38.3 66.59,36.16 66.59,25.84 57.3,16.55 56.35,16.55 55.56,15.76 55.56,12.59 50.32,7.35 X2.4
START_BTN  (via drill 0.35)
  Top 0.152: 77.15,26.4 76.67,25.92 76.67,20.68 77.31,20.05 78.26,20.05 C4.1 R4.1 | v64.92,45.45 60.16,45.45 59.21,46.4 59.21,48.62 57.94,49.89 44.6,49.89 44.29,49.57 27.77,49.57 26.19,51.16 K1.15 | v76.35,26.71 76.67,26.4 77.15,26.4 | DS3.2 77.15,26.4
  Bottom 0.152: v64.92,45.45 76.35,34.02 v76.35,26.71
START_LED
  Top 0.152: TBD.17 48.41,47.35 50.95,44.81 70.95,44.81 83.97,31.79 83.97,16.16 82.31,14.49 80.64,14.49 80.48,14.33 80.48,7.78 X1-BTN.8
STATE_LED  (via drill 0.35)
  Top 0.152: v66.03,43.54 56.03,43.54 55.08,44.49 48.73,44.49 45.87,47.35 TBD.18
  Bottom 0.152: v66.03,43.54 75.72,33.86 75.72,26.4 76.03,26.08 77.31,26.08 78.26,27.03 78.89,27.03 82.39,23.54 82.39,9.17 84.49,7.07 X1-BTN.10
TANK_RELAY
  Top 0.152: TBD.14 55.71,47.67 54.13,49.26 45.24,49.26 39.92,43.94 X6-REL+PUMP.1
THERMI1
  Top 0.152: R20.2 12.06,22.91 X5-THERMI.2
THERMI2
  Top 0.152: R21.2 14.6,23.86 X5-THERMI.4
THERMI3
  Top 0.152: R22.2 17.14,23.86 X5-THERMI.6
THERMI4
  Top 0.152: R23.2 21.11,20.68 20,19.57 X5-THERMI.8
TX_A
  Top 0.152: R1.2 56.03,16.24 53.49,16.24 52.22,14.97 51.9,14.97 U1.J5_9
TX_PI  (via drill 0.35)
  Top 0.152: v53.81,22.9 R2.1 | v35.6,36.03 36.13,36.03 36.14,36.04 36.96,36.04 37.62,35.38 v37.62,33.7
  Bottom 0.152: K1.8 17.13,53.78 18.12,54.77 18.94,54.77 19.52,54.19 19.52,53.7 20.49,52.73 24.09,52.73 25,51.83 25,46.16 34.51,36.64 34.67,36.64 35.28,36.03 v35.6,36.03 | v37.62,33.7 37.62,32.75 47.46,22.9 v53.81,22.9
VDD  (via drill 0.35)
  Top 0.152: DS4.3 82.07,27.03 79.84,27.03 DS4.4 79.53,27.03 77.62,27.03 DS3.3 77.31,27.35 75.08,27.35 DS3.4 74.76,27.03 74.13,27.03 71.27,24.17 68.42,24.17 59.53,15.28 59.53,14.97 U1.J5_12 59.21,14.65 57.62,13.06 31.27,13.06 30,14.33 30,15.6 32.54,18.14 33.49,18.14 | 3.96,31.79 3.96,34.97 3.65,34.97 R12.2 | 33.49,20.68 33.49,18.14 | v29.04,20.68 33.49,20.68 | v23.01,30.21 20.79,30.21 DS2.4 20.47,30.21 17.93,30.21 DS2.3 17.61,30.21 14.44,30.21 DS1.4 14.12,30.21 11.58,30.21 DS1.3 11.27,30.52 10.63,30.52 9.99,29.89 5.87,29.89 3.96,31.79 | 33.49,20.68 DS5.3 | 3.96,31.79 C1.1 | 33.49,18.14 DS5.4
  Bottom 0.152: v29.04,20.68 23.01,26.71 v23.01,30.21

### Text on the board
tNames: 2 / 1 | 8 / 7 | github.com/AKUINO/MICHA | MICHA V4.0 | +12V | GND